# EAGLE design Weather Station Data v3 (EAGLE 6.5.0)
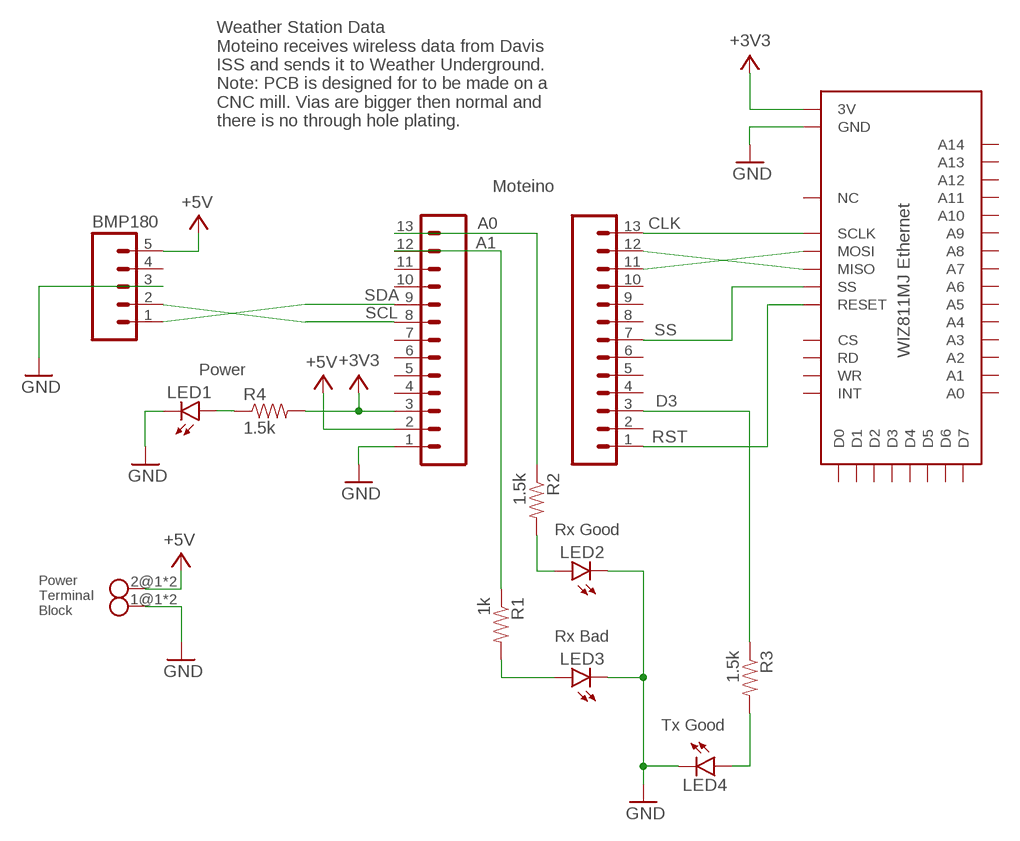
[diagram p0: schematic, sheet 1]

## Parts
BMP180  M05PTH_LONGPADS  [1X05_LONGPADS]
JP1  M13LONGPADS  [1X13-LONGPADS]
JP2  M13LONGPADS  [1X13-LONGPADS]
LED1  754-1440-1-ND  LED1206  [LED-1206]
LED2  754-1440-1-ND  LED1206  [LED-1206]
LED3  754-1143-1-ND  LED1206  [LED-1206]
LED4  754-1440-1-ND  LED1206  [LED-1206]
POWER  SPRING_TB_RT2  [SPRING_TB_RT2]
R1  1k  RESISTORAXIAL-0.3  [AXIAL-0.3]
R2  1.5k  RESISTORAXIAL-0.3  [AXIAL-0.3]
R3  1.5k  RESISTORAXIAL-0.3  [AXIAL-0.3]
R4  1.5k  RESISTORAXIAL-0.3  [AXIAL-0.3]
U$1  WIZ811MJ  [WIZ811MJ]

## Nets
+3V3: JP1.3 R4.P$2 U$1.3V@1(3V) U$1.3V@2(3V)
+5V: BMP180.5 JP1.2 POWER.2@1 POWER.2@2
A0: JP1.13 R2.P$1
A1: JP1.12 R1.P$1
CLK: JP2.13 U$1.SCLK
D3: JP2.3 R3.P$1
GND: BMP180.3 JP1.1 LED1.C LED2.C LED3.C LED4.C POWER.1@1 POWER.1@2 U$1.GND@1(GND) U$1.GND@2(GND) U$1.GND@3(GND) U$1.GND@4(GND) U$1.GND@5(GND)
MISO: JP2.12 U$1.MISO
MOSI: JP2.11 U$1.MOSI
N$1: LED1.A R4.P$1
N$2: LED2.A R2.P$2
N$3: LED4.A R3.P$2
N$4: LED3.A R1.P$2
RST: JP2.1 U$1.RESET
SCL: BMP180.2 JP1.8
SDA: BMP180.1 JP1.9
SS: JP2.7 U$1.SCS(SS)
Unconnected: BMP180.4 JP1.4 JP1.5 JP1.6 JP1.7 JP1.10 JP1.11 JP2.2 JP2.4 JP2.5 JP2.6 JP2.8 JP2.9 JP2.10 U$1.A0 U$1.A1 U$1.A2 U$1.A3 U$1.A4 U$1.A5 U$1.A6 U$1.A7 U$1.A8 U$1.A9 U$1.A10 U$1.A11 U$1.A12 U$1.A13 U$1.A14 U$1.CS U$1.D0 U$1.D1 U$1.D2 U$1.D3 U$1.D4 U$1.D5 U$1.D6 U$1.D7 U$1.INT U$1.NC U$1.RD U$1.WR

## Notes on the sheet
- Weather Station Data
  Moteino receives wireless data from Davis
  ISS and sends it to Weather Underground.
  Note: PCB is designed for to be made on a
  CNC mill. Vias are bigger then normal and
  there is no through hole plating.
- Moteino
- Power
- Rx Good
- Power 
  Terminal 
  Block
- Rx Bad
- Tx Good

## Library data of the parts
BMP180 = SparkFun-Connectors:M05: Header 5 Standard 5-pin 0.1" header. Use with straight break away headers (SKU : PRT-00116), right angle break away headers (PRT-00553), swiss pins (PRT-00743), machine pins (PRT-00117), and female headers (PRT-00115). Molex polarized connector foot print use with SKU : PRT-08230 with associated crimp pins and housings.
JP1 JP2 = SparkFun-Connectors:M13: 13-pin single row .1" header
LED1-LED4 = SparkFun-LED:LED: LEDs Standard schematic elements and footprints for 5mm, 3mm, 1206, and 0603 sized LEDs. 5mm - Spark Fun Electronics SKU : COM-00529 (and others)
POWER = SRG:SPRING_TB_RT2: Spring Loaded Terminal Block 4UCON 0.10 pitch right angle 2 amps 20-26 AWG Adafruit: P/N 1074 <http://www.adafruit.com/products/1074> Terminal block comes with 3 terminals, but the are modular so you can add or remove terminals
R1-R4 = SparkFun-Resistors:RESISTOR: Resistor Basic schematic elements and footprints for 0603, 1206, and PTH resistors.
U$1 = SRG:WIZ811MJ: WIZnet W5100 Ethernet Network Module - WIZ811MJ Sparkfun https://www.sparkfun.com/products/9473 Product Page: http://bly/U4KDqQ

## Net classes
0 default: width 0.508 mm, drill 0.254 mm, clearance 0.381 mm

## Board
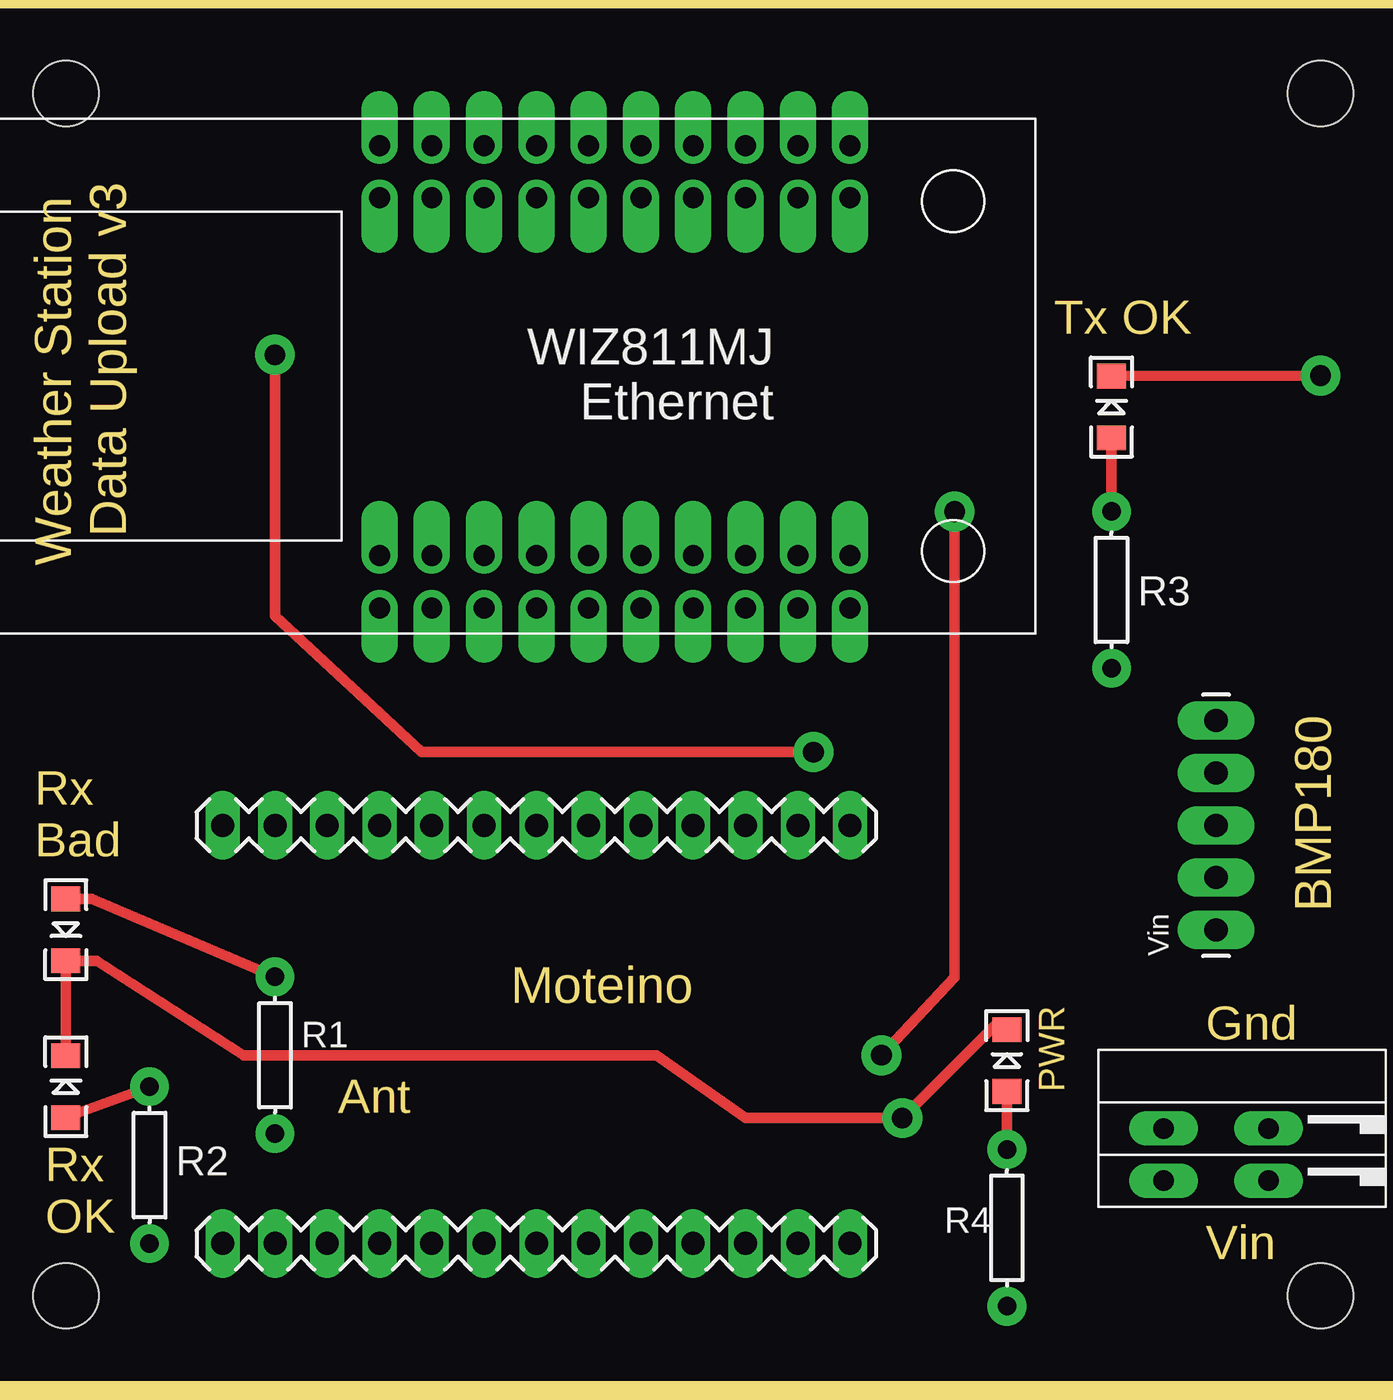
[diagram p1: board, top side]
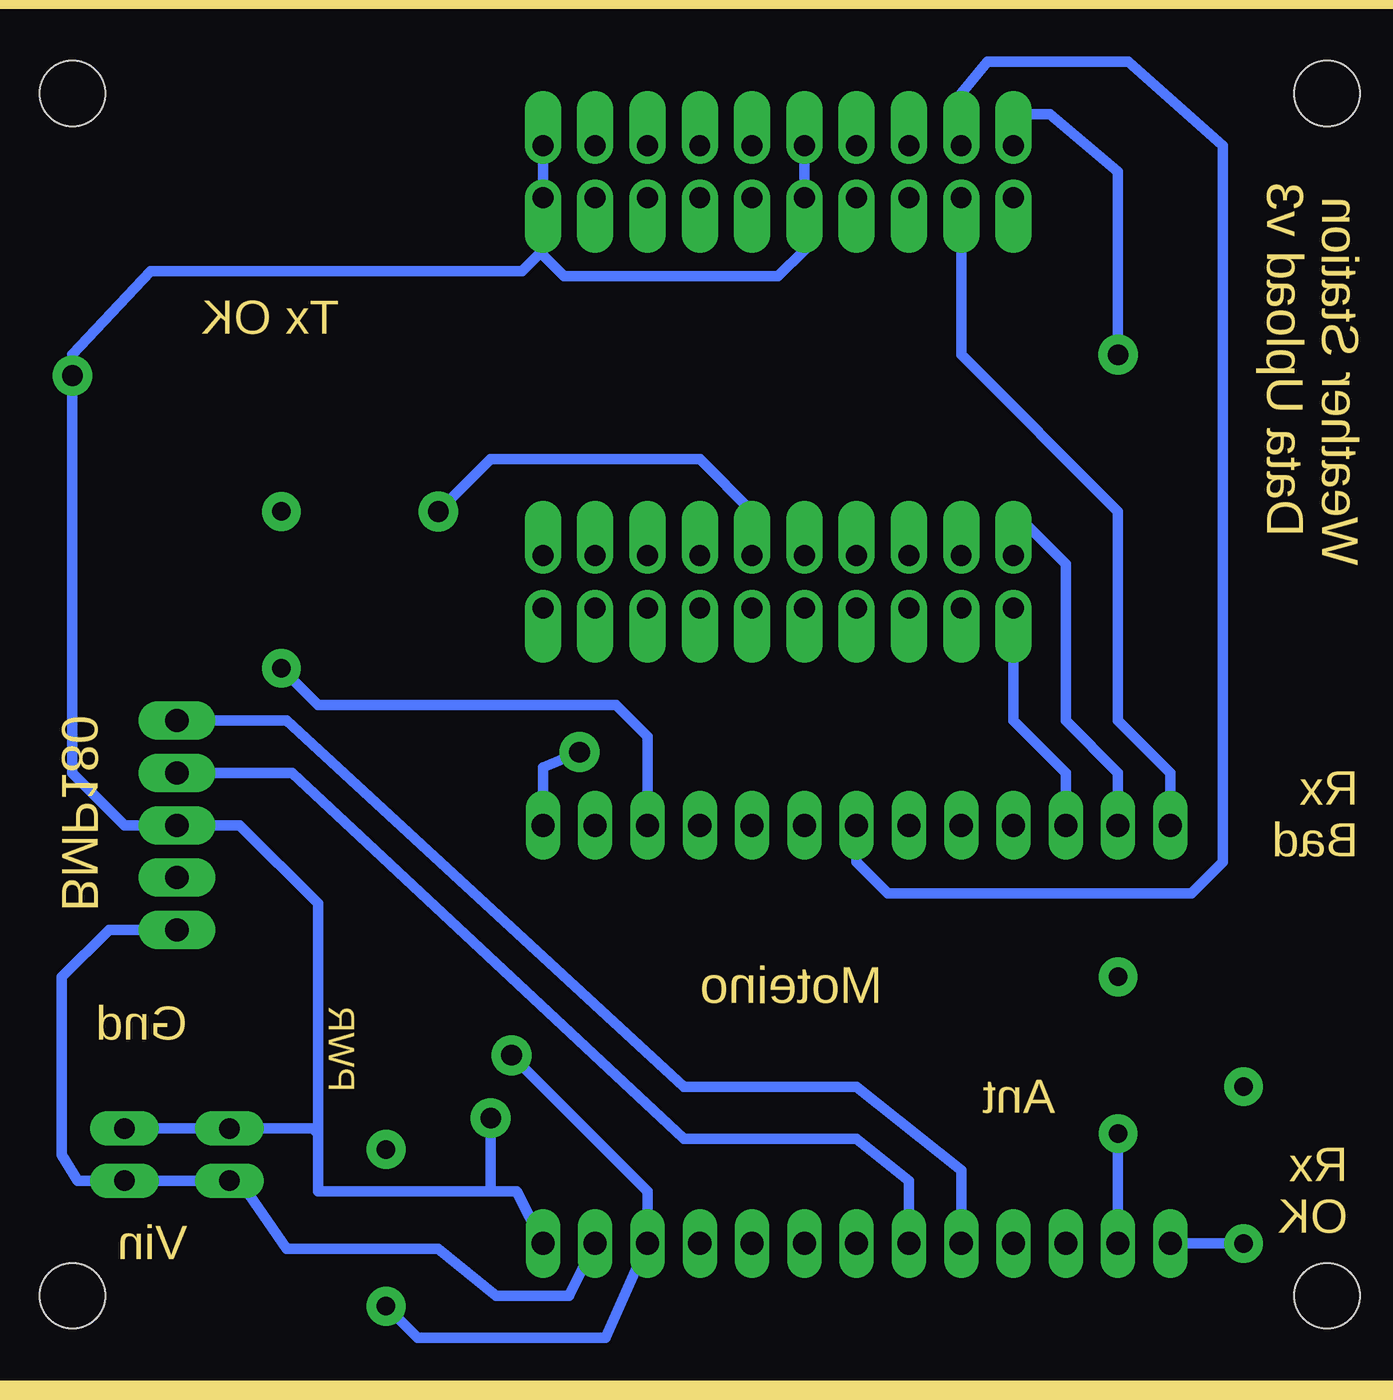
[diagram p2: board, bottom side, seen from below]

No outline drawn. Coordinates in mm, seen from the top.
Copper layers (1*16): Top 0.035mm / dielectric 1.5mm / Bottom 0.035mm
Design rules "ShapeOko": minimum track width 12mil, minimum drill 24mil, track to track 25mil, track to pad 25mil, pad to pad 25mil, via to via 25mil, smd to smd 25mil, copper to edge 40mil, drill to drill 8mil, minimum pad ring 10mil, minimum via ring 8mil, stop-mask expansion 4mil, vias tented up to drill 0mil, thermal gap 10mil
Holes 3.17 mm at 66.04,63.5 5.08,63.5 5.08,5.08 66.04,5.08
Holes 0.6 mm at 71.12,0 0,0 0,68.58 71.12,68.58
Milling: 4 lines

### Footprints (pad centres in the part's own frame; a part is rotated, then mirrored left to right if it is on the bottom)
1X05_LONGPADS = drill 1.118 pad 1.88 long: 1 0,0; 2 2.54,0; 3 5.08,0; 4 7.62,0; 5 10.16,0
1X13-LONGPADS = drill 1.118 long: 1 0,0; 2 2.54,0; 3 5.08,0; 4 7.62,0; 5 10.16,0; 6 12.7,0; 7 15.24,0; 8 17.78,0; 9 20.32,0; 10 22.86,0; 11 25.4,0; 12 27.94,0; 13 30.48,0
LED-1206 = smd 1.2 x 1.4: A -1.5,0; C 1.5,0
SPRING_TB_RT2 = drill 1 pad 1.676 long: 1@1 -1.27,2.54; 1@2 -1.27,-2.54; 2@1 1.27,2.54; 2@2 1.27,-2.54
AXIAL-0.3 = drill 0.9 pad 1.88: P$1 -3.81,0; P$2 3.81,0
WIZ811MJ = drill 1.016 pad 1.778 offset: 3V@1 10.16,9.76; 3V@2 22.86,-7.62; A0 10.16,-7.62; A1 10.16,-10.16; A2 7.62,-7.62; A3 7.62,-10.16; A4 5.08,-7.62; A5 5.08,-10.16; A6 2.54,-7.62; A7 2.54,-10.16; A8 7.62,12.3; A9 7.62,9.76; A10 5.08,12.3; A11 5.08,9.76; A12 2.54,12.3; A13 2.54,9.76; A14 0,12.3; CS 15.24,-7.62; D0 20.32,9.76; D1 20.32,12.3; D2 17.78,9.76; D3 17.78,12.3; D4 15.24,9.76; D5 15.24,12.3; D6 12.7,9.76; D7 12.7,12.3; GND@1 10.16,12.3; GND@2 12.7,-7.62; GND@3 0,-7.62; GND@4 12.7,-10.16; GND@5 0,-10.16; INT 15.24,-10.16; MISO 22.86,9.76; MOSI 22.86,12.3; NC 0,9.76; RD 17.78,-10.16; RESET 22.86,-10.16; SCLK 20.32,-7.62; SCS 20.32,-10.16; WR 17.78,-7.62

### Placement (x,y rotation side)
BMP180  60.96,33.02 270 top
JP1  43.18,7.62 180 top
JP2  43.18,27.94 180 top
LED1  50.8,16.51 90 top
LED2  5.08,15.24 90 top
LED3  5.08,22.86 270 top
LED4  55.88,48.26 90 top
POWER  60.96,11.94 270 top
R1  15.24,16.76 90 top
R2  9.14,11.43 90 top
R3  55.88,39.37 90 top
R4  50.8,8.38 270 top
U$1  43.18,50.8 180 top

### Tracks (layer width: path | path; a pad name or v marks a point on that pad's centre or on a via)
+3V3  (via drill 1 pad 1.93)
  Top 0.508: v44.7,16.76 44.68,16.74 48.26,20.55 v48.26,43.18
  Bottom 0.508: v44.7,16.76 38.1,10.16 JP1.3 40.13,3.05 49.28,3.05 R4.P$2 | U$1.3V@1 33.02,43.18 35.56,45.72 45.72,45.72 v48.26,43.18
+5V
  Bottom 0.508: 57.66,10.67 57.91,10.67 | 57.91,10.67 POWER.2@2 POWER.2@1 65.79,10.67 66.55,11.94 66.55,20.57 64.26,22.86 BMP180.5 | JP1.2 41.91,5.08 45.47,5.08 48.26,7.37 55.63,7.37 57.91,10.67
A0
  Bottom 0.508: R2.P$1 JP1.13
A1
  Bottom 0.508: R1.P$1 JP1.12
CLK
  Bottom 0.508: JP2.13 12.7,30.48 15.24,33.02 15.24,43.18 22.86,50.8 U$1.SCLK
D3
  Bottom 0.508: JP2.3 38.1,32.26 39.62,33.78 54.1,33.78 R3.P$1
GND  (via drill 1 pad 1.93)
  Top 0.508: LED2.C LED3.C 6.58,21.36 13.72,16.76 33.78,16.76 38.1,13.72 v45.72,13.72 50.29,18.29 LED1.C | LED4.C v66.04,49.78
  Bottom 0.508: JP1.1 44.45,10.16 45.72,10.16 | 45.72,10.16 54.1,10.16 54.1,12.95 | 54.1,12.95 54.1,24.13 57.91,27.94 BMP180.3 63.5,27.94 66.04,30.48 v66.04,49.78 66.04,50.8 62.23,54.86 44.2,54.86 43.18,55.88 U$1.GND@3 | 54.1,12.95 54.36,13.21 POWER.1@2 POWER.1@1 | v45.72,13.72 45.72,10.16 | U$1.GND@4 U$1.GND@2 30.48,55.88 31.75,54.61 42.16,54.61 43.18,55.63 U$1.GND@3 | U$1.GND@5 U$1.GND@3
MISO
  Bottom 0.381: 20.32,43.18 U$1.MISO
  Bottom 0.508: JP2.12 15.24,30.48 17.78,33.02 17.78,40.64 20.32,43.18
MOSI
  Bottom 0.508: JP2.11 17.78,30.48 20.32,33.02 U$1.MOSI
N$1
  Top 0.508: R4.P$1 LED1.A
N$2
  Top 0.508: LED2.A R2.P$2
N$3
  Top 0.508: LED4.A R3.P$2
N$4
  Top 0.508: LED3.A 6.33,24.36 R1.P$2
RST  (via drill 1 pad 1.93)
  Top 0.508: v41.4,31.5 22.35,31.5 15.24,38.1 v15.24,50.8
  Bottom 0.508: JP2.1 43.18,30.73 v41.4,31.5 | v15.24,50.8 15.24,59.69 18.54,62.48 20.32,62.48 U$1.RESET
SCL
  Bottom 0.508: JP1.8 25.4,10.67 27.94,12.7 36.32,12.7 55.37,30.48 BMP180.2
SDA
  Bottom 0.508: JP1.9 22.86,11.18 27.94,15.24 36.32,15.24 55.63,33.02 BMP180.1
SS
  Bottom 0.508: JP2.7 27.94,26.16 26.42,24.64 11.68,24.64 10.16,26.16 10.16,60.96 14.73,65.02 21.59,65.02 22.86,63.5 U$1.SCS

### Text on the board
tPlace: Vin
Milling: Weather Station / Data Upload v3 | Tx OK | BMP180 | Rx / Bad | Moteino | Gnd | PWR | Ant | Rx / OK | Vin